# Altium schematic sheet mcu.SchDoc: Triumvi - CC2538
size Letter; Author: Ye-Sheng Kuo; Revision: 11; SheetNumber: 7; SheetTotal: 10
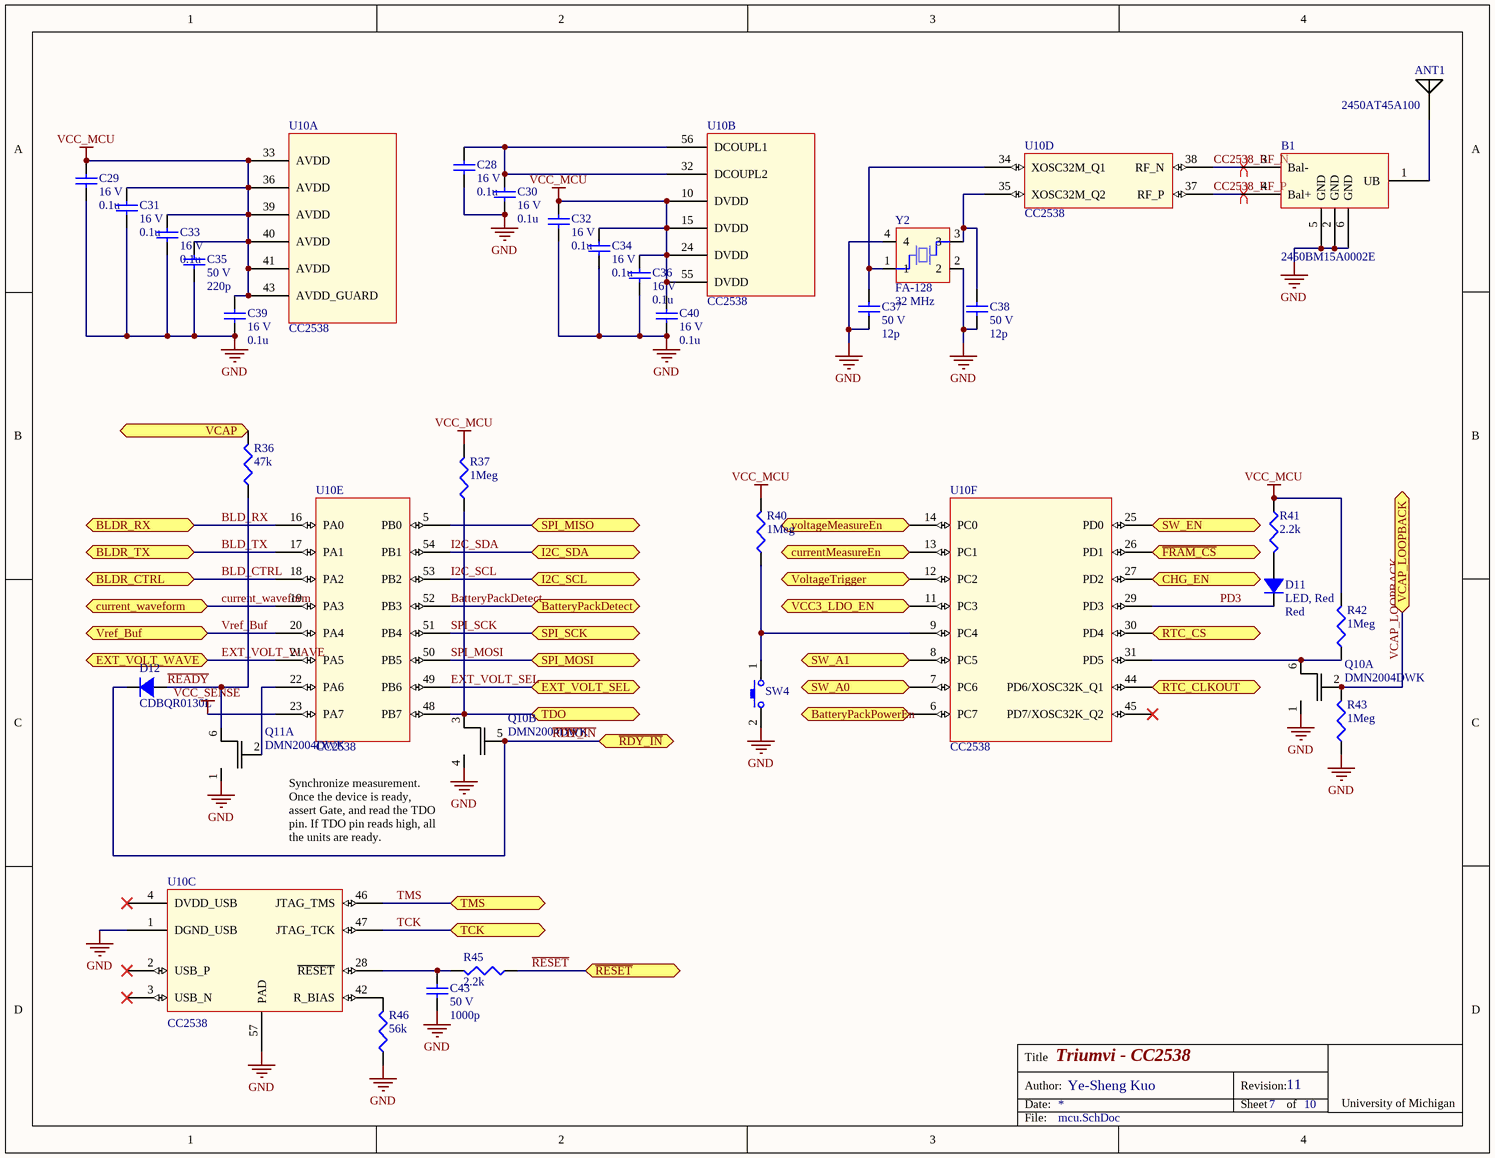
[diagram p0: mcu.SchDoc]

## Parts
ANT1  2450AT45A100  [2450AT45A100]
B1  2450BM15A0002E  [2450BM15A0002]
C28  voltage rated: 16 V  [0402]  (hidden comment: 0.1u)
C29  voltage rated: 16 V  [0402]  (hidden comment: 0.1u)
C30  voltage rated: 16 V  [0402]  (hidden comment: 0.1u)
C31  voltage rated: 16 V  [0402]  (hidden comment: 0.1u)
C32  voltage rated: 16 V  [0402]  (hidden comment: 0.1u)
C33  voltage rated: 16 V  [0402]  (hidden comment: 0.1u)
C34  voltage rated: 16 V  [0402]  (hidden comment: 0.1u)
C35  voltage rated: 50 V  [0402]  (hidden comment: 220p)
C36  voltage rated: 16 V  [0402]  (hidden comment: 0.1u)
C37  voltage rated: 50 V  [0402]  (hidden comment: 12p)
C38  voltage rated: 50 V  [0402]  (hidden comment: 12p)
C39  voltage rated: 16 V  [0402]  (hidden comment: 0.1u)
C40  voltage rated: 16 V  [0402]  (hidden comment: 0.1u)
C43  voltage rated: 50 V  [0402]  (hidden comment: 1000p)
D11  LED, Red  value Red  [0402 - LED]
D12  CDBQR0130L  [0402 - DIODE]
Q10  DMN2004DWK  [SC70-6]  (parts A,B of 2)
Q11  DMN2004DWK  [SC70-6]  (part A of 2)
R36  47k  [0402]
R37  1Meg  [0402]
R40  1Meg  [0402]
R41  2.2k  [0402]
R42  1Meg  [0402]
R43  1Meg  [0402]
R45  2.2k  [0402]
R46  56k  [0402]
SW4  EVQP7C  [EVQP7C]  (value not drawn)
U10  CC2538  [QFN56]  (parts A,B,C,D,E,F of 6)
Y2  FA-128  frequency: 32 MHz  [FA-128]

## Ports
BatteryPackDetect, BatteryPackPowerEn, BLDR_CTRL, BLDR_RX, BLDR_TX, CHG_EN, current_waveform, currentMeasureEn, EXT_VOLT_SEL, EXT_VOLT_WAVE, I2C_SCL, I2C_SDA, RTC_CLKOUT, RTC_CS, SPI_MISO, SPI_MOSI, SPI_SCK, SW_A0, SW_A1, SW_EN, TCK, TDO, TMS, VCAP, VCAP_LOOPBACK, VCC3_LDO_EN, voltageMeasureEn, VoltageTrigger, Vref_Buf, ~{FRAM_CS}, ~{RDY_IN}, ~{RESET}

## Nets
GND: B1.2(GND) B1.5(GND) B1.6(GND) C28.2 C29.2 C30.2 C31.2 C32.2 C33.2 C34.2 C35.2 C36.2 C37.2 C38.2 C39.2 C40.2 C43.2 Q10.1(S2) Q10.4(S1) Q11.1(S2) R43.2 R46.2 SW4.2 U10.1(DGND_USB) U10.57(PAD) Y2.2 Y2.4
VCC_MCU: C29.1 C31.1 C32.1 C33.1 C34.1 C35.1 C36.1 C39.1 C40.1 R37.1 R40.1 R41.2 R42.1 U10.10(DVDD) U10.15(DVDD) U10.24(DVDD) U10.33(AVDD) U10.36(AVDD) U10.39(AVDD) U10.40(AVDD) U10.41(AVDD) U10.43(AVDD_GUARD) U10.55(DVDD)
VCC_SENSE: U10.23(PA7)
BatteryPackDetect: U10.52(PB3) ; port BatteryPackDetect
BatteryPackPowerEn: U10.6(PC7) ; port BatteryPackPowerEn
BLD_CTRL: U10.18(PA2) ; port BLDR_CTRL
BLD_RX: U10.16(PA0) ; port BLDR_RX
BLD_TX: U10.17(PA1) ; port BLDR_TX
CC2538_RF_N: B1.3(Bal-) U10.38(RF_N)
CC2538_RF_P: B1.4(Bal+) U10.37(RF_P)
CHG_EN: U10.27(PD2) ; port CHG_EN
current_waveform: U10.19(PA3) ; port current_waveform
currentMeasureEn: U10.13(PC1) ; port currentMeasureEn
EXT_VOLT_SEL: U10.49(PB6) ; port EXT_VOLT_SEL
EXT_VOLT_WAVE: U10.21(PA5) ; port EXT_VOLT_WAVE
~{FRAM_CS}: U10.26(PD1) ; port ~{FRAM_CS}
I2C_SCL: U10.53(PB2) ; port I2C_SCL
I2C_SDA: U10.54(PB1) ; port I2C_SDA
PD3: D11.2 U10.29(PD3)
~{RDY_IN}: D12.2 Q10.5(G1) ; port ~{RDY_IN}  [also labelled TDO]
~{READY}: D12.1 Q11.6(D2) R36.2
~{RESET}: R45.2 ; port ~{RESET}
RTC_CLKOUT: U10.44(PD6/XOSC32K_Q1) ; port RTC_CLKOUT
RTC_CS: U10.30(PD4) ; port RTC_CS
SPI_MISO: U10.5(PB0) ; port SPI_MISO
SPI_MOSI: U10.50(PB5) ; port SPI_MOSI
SPI_SCK: U10.51(PB4) ; port SPI_SCK
SW_A0: U10.7(PC6) ; port SW_A0
SW_A1: U10.8(PC5) ; port SW_A1
SW_EN: U10.25(PD0) ; port SW_EN
TCK: U10.47(JTAG_TCK) ; port TCK
TDO: Q10.3(D1) R37.2 U10.48(PB7) ; port TDO
TMS: U10.46(JTAG_TMS) ; port TMS
VCAP: R36.1 ; port VCAP
VCAP_LOOPBACK: Q10.2(G2) R43.1 ; port VCAP_LOOPBACK
VCC3_LDO_EN: U10.11(PC3) ; port VCC3_LDO_EN
voltageMeasureEn: U10.14(PC0) ; port voltageMeasureEn
VoltageTrigger: U10.12(PC2) ; port VoltageTrigger
Vref_Buf: U10.20(PA4) ; port Vref_Buf
NetANT1_1: ANT1.1 B1.1(UB)
NetC28_1: C28.1 C30.1 U10.32(DCOUPL2) U10.56(DCOUPL1)
NetC37_1: C37.1 U10.34(XOSC32M_Q1) Y2.1
NetC38_1: C38.1 U10.35(XOSC32M_Q2) Y2.3
NetC43_1: C43.1 R45.1 U10.28(~{RESET})
NetD11_1: D11.1 R41.1
NetQ10_6: Q10.6(D2) R42.2 U10.31(PD5)
NetQ11_2: Q11.2(G2) U10.22(PA6)
NetR40_2: R40.2 SW4.1 U10.9(PC4)
NetR46_1: R46.1 U10.42(R_BIAS)

Not connected (* = marked no-connect by the designer): U10 2(USB_P)* 3(USB_N)* 4(DVDD_USB)* 45(PD7/XOSC32K_Q2)*

## Layout directives
differential pair: CC2538_RF_N, CC2538_RF_P

## Notes on the sheet
- Synchronize measurement. Once the device is ready, assert Gate, and read the TDO pin. If TDO pin reads high, all the units are ready.
- Title
- Date:
- Author:
- Revision:
- Sheet
- of
- University of Michigan
- File:

## Library data of the parts
ANT1 = 2450AT45A100: 2.45 GHz High Gain SMD Chip Antenna; Supplier 1: Digi-Key; Supplier Part Number 1: 712-1012-1-ND
B1 = 2450BM15A0002E: 2.45 GHz Balun for TI CC253X; Supplier 1: Digi-Key; Supplier Part Number 1: 712-1536-1-ND
C28-C34 C36 C39 C40 = GRM155R71C104KA88D: 0.10µF ±10% 16V Ceramic Capacitor X7R 0402; Manufacture: Murata; tolerance: 10%; package: 0402; Supplier 1: Digi-Key; Supplier Part Number 1: 490-3261-1-ND; Value: 0.1u; Temperature Coefficient: X7R; Manufacturer Part Number: GRM155R71C104KA88D
C35 = C0402C221K5RACTU: 220pF ±10% 50V Ceramic Capacitor X7R 0402; Manufacture: Kemet; tolerance: 10%; package: 0402; Supplier 1: Digi-Key; Supplier Part Number 1: 399-1030-1-ND; Value: 220p; Temperature Coefficient: X7R; Manufacturer Part Number: C0402C221K5RACTU
C37 C38 = 500R07S120GV4T: 12pF ±2% 50V Ceramic Capacitor C0G, NP0 0402; Manufacture: Johanson Technology Inc.; tolerance: 2%; package: 0402; Temperature Coefficient: C0G, NP0; Manufacturer Part Number: 500R07S120GV4T; Supplier 1: Digi-Key; Supplier Part Number 1: 712-1256-1-ND; Value: 12p
C43 = C1005C0G1H102J050BA: 1000pF ±5% 50V Ceramic Capacitor C0G, NP0 0402; Manufacture: TDK; tolerance: 5%; package: 0402; Supplier 1: Digi-Key; Supplier Part Number 1: 445-6846-1-ND; Value: 1000p; Temperature Coefficient: C0G, NP0; Manufacturer Part Number: C1005C0G1H102J050BA
D11 = SML-P12UTT86: Red 620nm LED Indication - Discrete 2V 2-SMD; Manufacturer: Rohm Semiconductor; Current @ VF: 20 mA; package: 0402; Supplier 1: Digi-Key; Supplier Part Number 1: 511-1593-1-ND; Forward Voltage: 2 V; Manufacturer Part Number: SML-P12UTT86; Wavelength: 620 nm
D12 = CDBQR0130L: Diode Schottky 30V 100mA Surface Mount 0402/SOD-923F; Manufacturer: Comchip Technology; Forward Voltage @ If: 350 mV @ 10 mA; Supplier 1: Digi-Key; Supplier Part Number 1: 641-1271-1-ND; Manufacturer Part Number: CDBQR0130L; current: 100 mA; reverse voltage: 30 V; diode type: Schottky
Q10 Q11 = DMN2004DWK: DUAL N-CHANNEL ENHANCEMENT MODE MOSFET; Supplier 1: Digi-Key; Supplier Part Number 1: DMN2004DWKDICT-ND
R36 = CRCW040247K0FKED: RES SMD 47K OHM 1% 1/16W 0402; Manufacturer: Vishay Dale; Temperature Coefficient: 100 ppm/C; Tolerance: 1%; Power: 1/16 W; package: 0402; Supplier 1: Digi-Key; Supplier Part Number 1: 541-47.0KLCT-ND; value: 47k; Manufacturer Part Number: CRCW040247K0FKED
R37 R40 R42 R43 = CRCW04021M00FKED: RES SMD 1M OHM 1% 1/16W 0402; Manufacturer: Vishay Dale; Temperature Coefficient: 100 ppm/C; Tolerance: 1%; Power: 1/16 W; Supplier 1: Digi-Key; Supplier Part Number 1: 541-1.00MLCT-ND; package: 0402; value: 1Meg; Manufacturer Part Number: CRCW04021M00FKED
R41 R45 = CRCW04022K20FKED: RES SMD 2.2K OHM 1% 1/16W 0402; Manufacturer: Vishay Dale; Temperature Coefficient: 100 ppm/C; Tolerance: 1%; Power: 1/16 W; package: 0402; Supplier 1: Digi-Key; Supplier Part Number 1: 541-2.20KLCT-ND; value: 2.2k; Manufacturer Part Number: CRCW04022K20FKED
R46 = CRCW040256K0FKED: RES SMD 56K OHM 1% 1/16W 0402; Manufacturer: Vishay Dale; Temperature Coefficient: 100 ppm/C; Power: 1/16 W; package: 0402; Supplier 1: Digi-Key; Supplier Part Number 1: 541-56.0KLCT-ND; Tolerance: 1%; value: 56k; Manufacturer Part Number: CRCW040256K0FKED
SW4 = EVQP7C: 3.5 mm×2.9 mm Side-operational SMD  Light Touch Switches; Supplier 1: Digi-Key; Supplier Part Number 1: P16769CT-ND
U10 = CC2538: A Powerful System-On-Chip for 2.4-GHz IEEE 802.15.4, 6LoWPAN  and ZigBee Applications; Supplier 1: Digi-Key; Supplier Part Number 1: 296-35797-1-ND
Y2 = FA-128: MHz Range Crystal Unit; Load capatance: 10 pF; ESR: 60; stability: 20 ppm; Supplier 1: Digi-Key; Supplier Part Number 1: SER3800CT-ND